# Altium schematic sheet breakout.SchDoc
size A
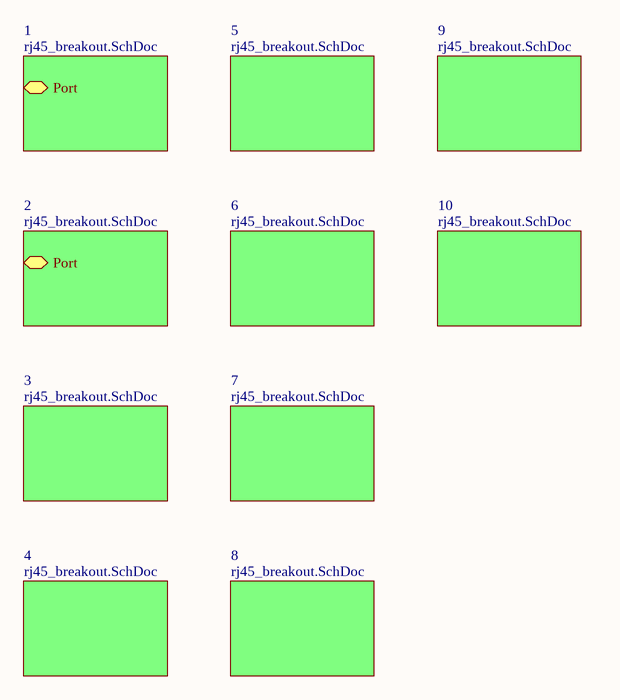
[diagram p0: breakout.SchDoc]

## Sub-sheets
1 = rj45_breakout.SchDoc: Port
2 = rj45_breakout.SchDoc: Port
3 = rj45_breakout.SchDoc: no entries
4 = rj45_breakout.SchDoc: no entries
5 = rj45_breakout.SchDoc: no entries
6 = rj45_breakout.SchDoc: no entries
7 = rj45_breakout.SchDoc: no entries
8 = rj45_breakout.SchDoc: no entries
9 = rj45_breakout.SchDoc: no entries
10 = rj45_breakout.SchDoc: no entries